# EAGLE design moduloComunicacao4.1-smd (EAGLE 9.5.2)
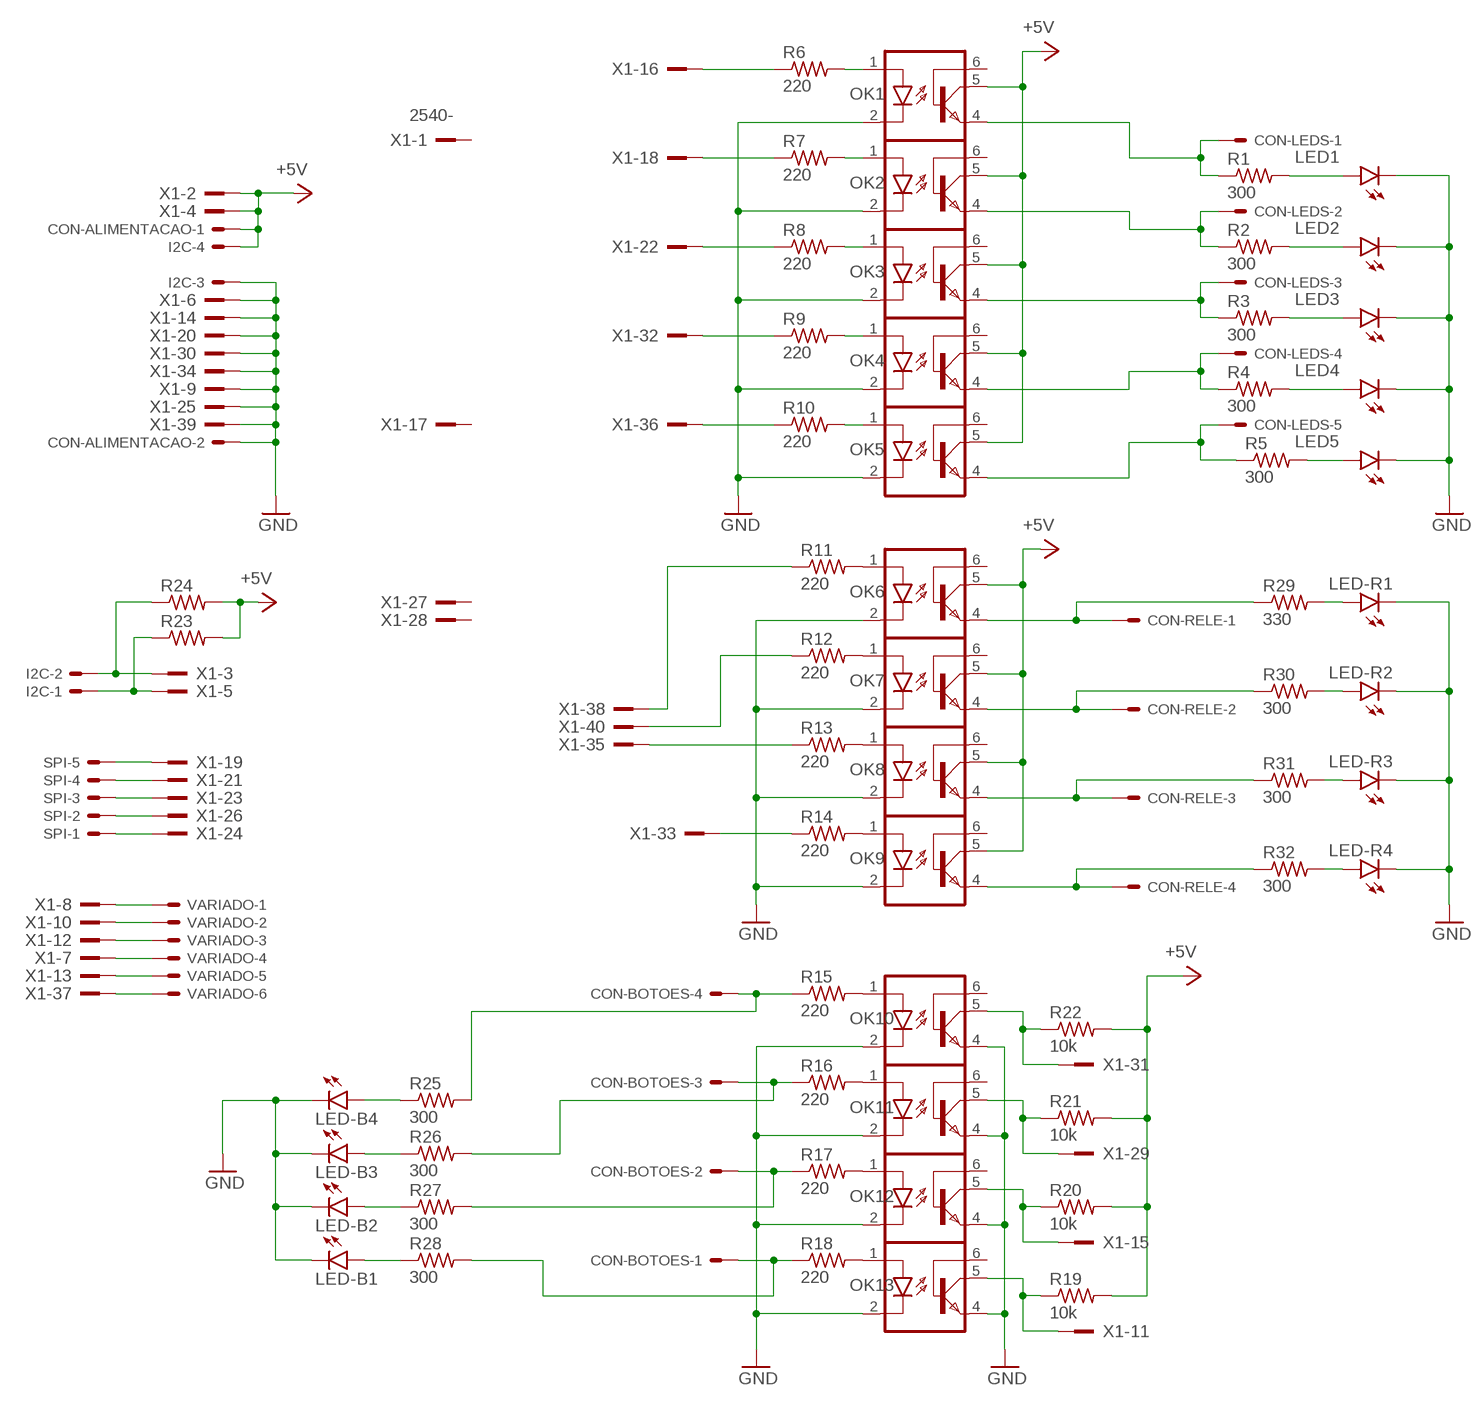
[diagram p0: schematic, sheet 1]

## Parts
CON-ALIMENTACAO  22-23-2021  [22-23-2021]
CON-BOTOES  22-23-2041  [22-23-2041]
CON-LEDS  22-23-2051  [22-23-2051]
CON-RELE  22-23-2041  [22-23-2041]
I2C  22-23-2041  [22-23-2041]
LED1  LED5MM  [LED5MM]
LED2  LED5MM  [LED5MM]
LED3  LED5MM  [LED5MM]
LED4  LED5MM  [LED5MM]
LED5  LED5MM  [LED5MM]
LED-B1  LEDCHIP-LED0805  [CHIP-LED0805]
LED-B2  LEDCHIP-LED0805  [CHIP-LED0805]
LED-B3  LEDCHIP-LED0805  [CHIP-LED0805]
LED-B4  LEDCHIP-LED0805  [CHIP-LED0805]
LED-R1  LEDCHIP-LED0805  [CHIP-LED0805]
LED-R2  LEDCHIP-LED0805  [CHIP-LED0805]
LED-R3  LEDCHIP-LED0805  [CHIP-LED0805]
LED-R4  LEDCHIP-LED0805  [CHIP-LED0805]
OK1  4N25M  [DIL06]
OK2  4N25M  [DIL06]
OK3  4N25M  [DIL06]
OK4  4N25M  [DIL06]
OK5  4N25M  [DIL06]
OK6  4N25M  [DIL06]
OK7  4N25M  [DIL06]
OK8  4N25M  [DIL06]
OK9  4N25M  [DIL06]
OK10  4N25M  [DIL06]
OK11  4N25M  [DIL06]
OK12  4N25M  [DIL06]
OK13  4N25M  [DIL06]
R1  300  R-US_0207/12  [0207/12]
R2  300  R-US_0207/12  [0207/12]
R3  300  R-US_0207/12  [0207/12]
R4  300  R-US_0207/12  [0207/12]
R5  300  R-US_0207/12  [0207/12]
R6  220  R-US_0204/7  [0204/7]
R7  220  R-US_0204/7  [0204/7]
R8  220  R-US_0204/7  [0204/7]
R9  220  R-US_0204/7  [0204/7]
R10  220  R-US_0204/7  [0204/7]
R11  220  R-US_0204/7  [0204/7]
R12  220  R-US_0204/7  [0204/7]
R13  220  R-US_0204/7  [0204/7]
R14  220  R-US_0204/7  [0204/7]
R15  220  R-US_0207/10  [0207/10]
R16  220  R-US_0207/10  [0207/10]
R17  220  R-US_0207/10  [0207/10]
R18  220  R-US_0207/10  [0207/10]
R19  10k  R-US_0204/7  [0204/7]
R20  10k  R-US_0204/7  [0204/7]
R21  10k  R-US_0204/7  [0204/7]
R22  10k  R-US_0204/7  [0204/7]
R23  R-US_0204/5  [0204/5]
R24  R-US_0204/5  [0204/5]
R25  300  R-US_R0805  [R0805]
R26  300  R-US_R0805  [R0805]
R27  300  R-US_R0805  [R0805]
R28  300  R-US_R0805  [R0805]
R29  330  R-US_R0805  [R0805]
R30  300  R-US_R0805  [R0805]
R31  300  R-US_R0805  [R0805]
R32  300  R-US_R0805  [R0805]
SPI  22-23-2051  [22-23-2051]
VARIADO  22-23-2061  [22-23-2061]
X1  2540-  [PAK100/2500-40]

## Nets
+5V: CON-ALIMENTACAO.1 I2C.4 OK1.5(COL) OK2.5(COL) OK3.5(COL) OK4.5(COL) OK5.5(COL) OK6.5(COL) OK7.5(COL) OK8.5(COL) OK9.5(COL) R19.2 R20.2 R21.2 R22.2 R23.2 R24.2 X1.2 X1.4
GND: CON-ALIMENTACAO.2 I2C.3 LED1.K(C) LED2.K(C) LED3.K(C) LED4.K(C) LED5.K(C) LED-B1.C LED-B2.C LED-B3.C LED-B4.C LED-R1.C LED-R2.C LED-R3.C LED-R4.C OK1.2(C) OK2.2(C) OK3.2(C) OK4.2(C) OK5.2(C) OK6.2(C) OK7.2(C) OK8.2(C) OK9.2(C) OK10.2(C) OK10.4(EMI) OK11.2(C) OK11.4(EMI) OK12.2(C) OK12.4(EMI) OK13.2(C) OK13.4(EMI) X1.6 X1.9 X1.14 X1.20 X1.25 X1.30 X1.34 X1.39
N$1: LED1.A R1.2
N$2: LED2.A R2.2
N$3: LED3.A R3.2
N$4: LED4.A R4.2
N$5: LED5.A R5.2
N$6: CON-LEDS.1 OK1.4(EMI) R1.1
N$7: CON-LEDS.2 OK2.4(EMI) R2.1
N$8: CON-LEDS.3 OK3.4(EMI) R3.1
N$9: CON-LEDS.4 OK4.4(EMI) R4.1
N$10: CON-LEDS.5 OK5.4(EMI) R5.1
N$11: CON-RELE.1 OK6.4(EMI) R29.1
N$12: CON-RELE.2 OK7.4(EMI) R30.1
N$13: OK1.1(A) R6.2
N$14: OK2.1(A) R7.2
N$15: OK3.1(A) R8.2
N$16: OK4.1(A) R9.2
N$17: OK5.1(A) R10.2
N$18: CON-RELE.3 OK8.4(EMI) R31.1
N$19: CON-RELE.4 OK9.4(EMI) R32.1
N$20: OK6.1(A) R11.2
N$21: OK7.1(A) R12.2
N$22: OK8.1(A) R13.2
N$23: OK9.1(A) R14.2
N$24: OK10.1(A) R15.2
N$25: OK11.1(A) R16.2
N$26: OK12.1(A) R17.2
N$27: OK13.1(A) R18.2
N$28: CON-BOTOES.4 R15.1 R25.2
N$29: CON-BOTOES.2 R17.1 R27.2
N$30: CON-BOTOES.3 R16.1 R26.2
N$31: CON-BOTOES.1 R18.1 R28.2
N$32: OK13.5(COL) R19.1 X1.11
N$33: R13.1 X1.35
N$34: OK12.5(COL) R20.1 X1.15
N$35: R12.1 X1.40
N$36: OK11.5(COL) R21.1 X1.29
N$37: R14.1 X1.33
N$38: OK10.5(COL) R22.1 X1.31
N$39: R11.1 X1.38
N$40: R6.1 X1.16
N$41: R7.1 X1.18
N$42: R8.1 X1.22
N$43: R9.1 X1.32
N$44: R10.1 X1.36
N$45: I2C.2 R24.1 X1.3
N$46: I2C.1 R23.1 X1.5
N$47: SPI.5 X1.19
N$48: SPI.4 X1.21
N$49: SPI.3 X1.23
N$50: SPI.2 X1.26
N$51: SPI.1 X1.24
N$52: VARIADO.3 X1.12
N$53: VARIADO.2 X1.10
N$54: VARIADO.1 X1.8
N$55: VARIADO.4 X1.7
N$56: VARIADO.5 X1.13
N$57: VARIADO.6 X1.37
N$58: LED-B4.A R25.1
N$59: LED-B3.A R26.1
N$60: LED-B2.A R27.1
N$61: LED-B1.A R28.1
N$62: LED-R4.A R32.2
N$63: LED-R3.A R31.2
N$64: LED-R2.A R30.2
N$65: LED-R1.A R29.2
Unconnected: OK1.6(BAS) OK2.6(BAS) OK3.6(BAS) OK4.6(BAS) OK5.6(BAS) OK6.6(BAS) OK7.6(BAS) OK8.6(BAS) OK9.6(BAS) OK10.6(BAS) OK11.6(BAS) OK12.6(BAS) OK13.6(BAS) X1.1 X1.17 X1.27 X1.28

## Library data of the parts
CON-ALIMENTACAO = con-molex:22-23-2021: .100" (2.54mm) Center Header - 2 Pin; MF: MOLEX; MPN: 22-23-2021; OC_FARNELL: 1462926; OC_NEWARK: 25C3832
CON-BOTOES CON-RELE I2C = con-molex:22-23-2041: .100" (2.54mm) Center Header - 4 Pin; MF: MOLEX; MPN: 22-23-2041; OC_FARNELL: 1462920; OC_NEWARK: 38C0355
CON-LEDS SPI = con-molex:22-23-2051: .100" (2.54mm) Center Header - 5 Pin; MF: MOLEX; MPN: 22-23-2051; OC_FARNELL: 1462952; OC_NEWARK: 38C9178
LED1-LED5 LED-B1-LED-B4 LED-R1-LED-R4 = led:LED: LED OSRAM: - CHIPLED LG R971, LG N971, LY N971, LG Q971, LY Q971, LO R971, LY R971 LH N974, LH R974 LS Q976, LO Q976, LY Q976 LO Q996 - Hyper CHIPLED LW Q18S LB Q993, LB Q99A, LB R99A - SideLED LS A670, LO A670, LY A670, LG A670, LP A670 LB A673, LV A673, LT A673, LW A673 LH A674 LY A675 LS A676, LA A676, LO A676, LY A676, LW A676 LS A679, LY A679, LG A679 - Hyper Micro SIDELED® LS Y876, LA Y876, LO Y876, LY Y876 LT Y87S - SmartLED LW L88C, LW L88S LB L89C, LB L89S, LG L890 LS L89K, LO L89K, LY L89K LS L896, LA L896, LO L896, LY L896 - TOPLED LS T670, LO T670, LY T670, LG T670, LP T670 LSG T670, LSP T670, LSY T670, LOP T670, LYG T670 LG T671, LOG T671, LSG T671 LB T673, LV T673, LT T673, LW T673 LH T674 LS T676, LA T676, LO T676, LY T676, LB T676, LH T676, LSB T676, LW T676 LB T67C, LV T67C, LT T67C, LS T67K, LO T67K, LY T67K, LW E67C LS E67B, LA E67B, LO E67B, LY E67B, LB E67C, LV E67C, LT E67C LW T67C LS T679, LY T679, LG T679 LS T770, LO T770, LY T770, LG T770, LP T770 LB T773, LV T773, LT T773, LW T773 LH T774 LS E675, LA E675, LY E675, LS T675 LS T776, LA T776, LO T776, LY T776, LB T776 LHGB T686 LT T68C, LB T68C - Hyper Mini TOPLED® LB M676 - Mini TOPLED Santana® LG M470 LS M47K, LO M47K, LY M47K Source: http://www.osram.convergy.de LUXEON: - LUMILED® LXK2-PW12-R00, LXK2-PW12-S00, LXK2-PW14-U00, LXK2-PW14-V00 LXK2-PM12-R00, LXK2-PM12-S00, LXK2-PM14-U00 LXK2-PE12-Q00, LXK2-PE12-R00, LXK2-PE12-S00, LXK2-PE14-T00, LXK2-PE14-U00 LXK2-PB12-K00, LXK2-PB12-L00, LXK2-PB12-M00, LXK2-PB14-N00, LXK2-PB14-P00, LXK2-PB14-Q00 LXK2-PR12-L00, LXK2-PR12-M00, LXK2-PR14-Q00, LXK2-PR14-R00 LXK2-PD12-Q00, LXK2-PD12-R00, LXK2-PD12-S00 LXK2-PH12-R00, LXK2-PH12-S00 LXK2-PL12-P00, LXK2-PL12-Q00, LXK2-PL12-R00 Source: www.luxeon.com KINGBRIGHT: KA-3528ASYC Source: www.kingbright.com
OK1-OK13 = optocoupler:4N*?M: General Purpose 6-Pin Phototransistor Optocouplers Source: http://www.fairchildsemi.com/ds/4N/4N35-M.pdf; MPN: 4N25-M; OC_FARNELL: 1021349; OC_NEWARK: 98K9084
R1-R32 = rcl:R-US_: RESISTOR, American symbol; SPICEPREFIX: R
VARIADO = con-molex:22-23-2061: .100" (2.54mm) Center Header - 6 Pin; MF: MOLEX; MPN: 22-23-2061; OC_FARNELL: 1462922; OC_NEWARK: 27C1933
X1 = con-3m:2540-: 3M (TM) Pak 100 4-Wall Header Source: 3M; OC_FARNELL: unknown; OC_NEWARK: unknown

## Board
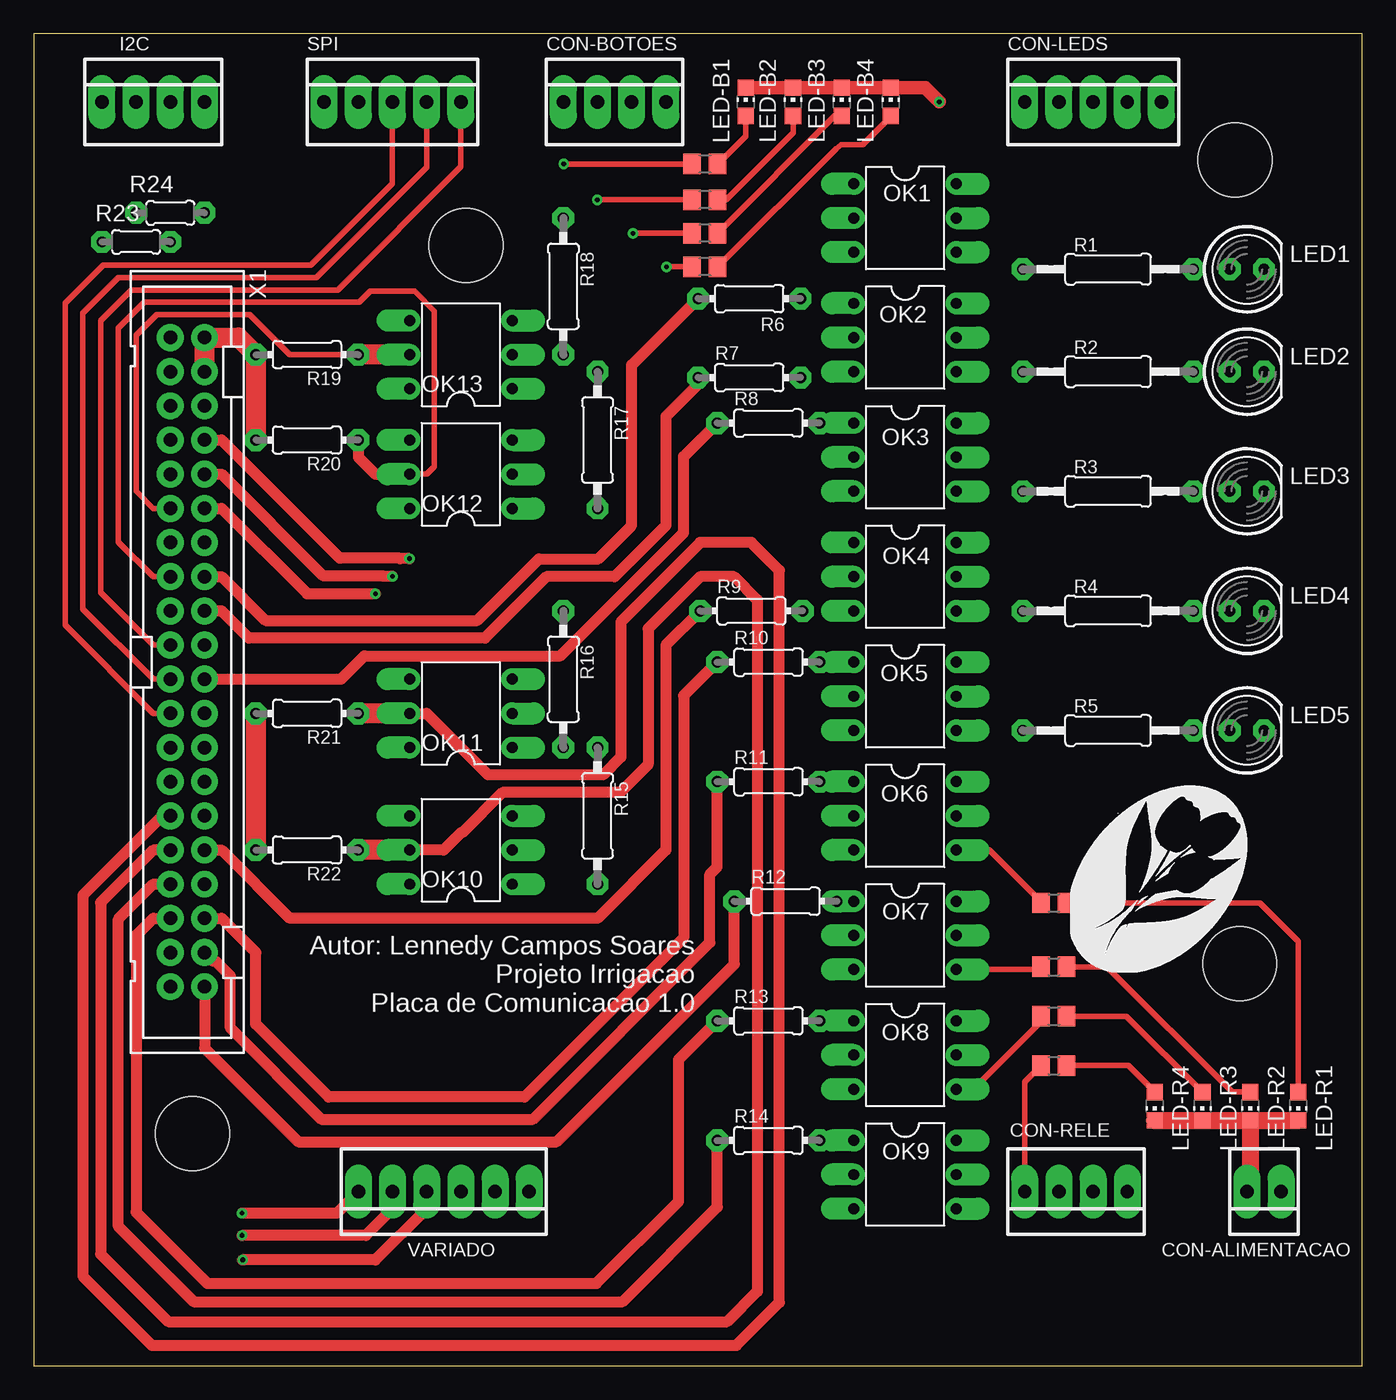
[diagram p1: board, top side]
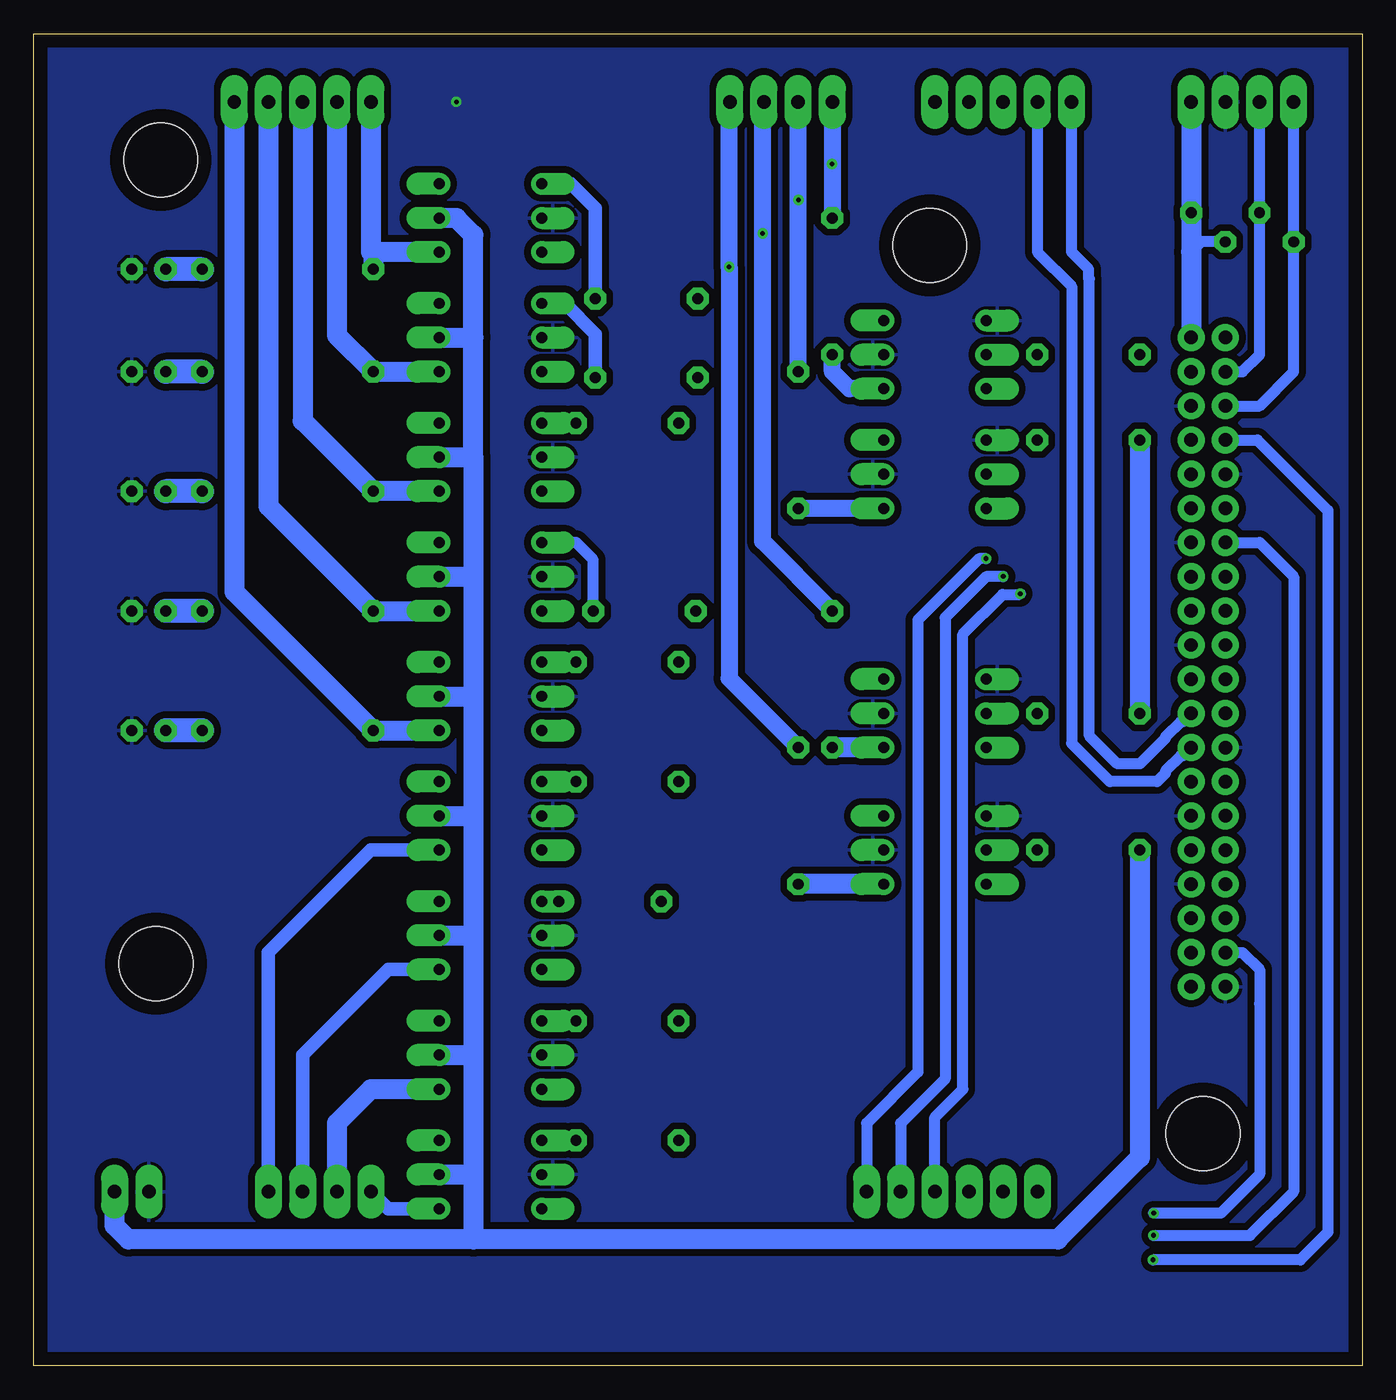
[diagram p2: board, bottom side, seen from below]

Size 98.73 x 99.05 mm. Coordinates in mm from the lower left corner, seen from the top.
Outline: 0,0 98.73,0 98.73,99.05 0,99.05 0,0
Copper layers (1*16): Top 0.035mm / dielectric 1.5mm / Bottom 0.035mm
Design rules "default *": minimum track width 6mil, minimum drill 0.35mm, track to track 20mil, track to pad 20mil, pad to pad 20mil, via to via 20mil, smd to smd 6mil, copper to edge 40mil, drill to drill 6mil, minimum pad ring 10mil, minimum via ring 8mil, stop-mask expansion 4mil, vias tented up to drill 0mil, thermal gap 10mil
Holes 5.5 mm at 11.81,17.27 89.64,29.9 32.13,83.31 89.28,89.66

### Footprints (pad centres in the part's own frame; a part is rotated, then mirrored left to right if it is on the bottom)
22-23-2021 = drill 1 long: 1 -1.27,0; 2 1.27,0
22-23-2041 = drill 1 long: 1 -3.81,0; 2 -1.27,0; 3 1.27,0; 4 3.81,0
22-23-2051 = drill 1 long: 1 -5.08,0; 2 -2.54,0; 3 0,0; 4 2.54,0; 5 5.08,0
LED5MM = drill 0.813 octagon: A -1.27,0; K 1.27,0
CHIP-LED0805 = smd 1.2 x 1.2: A 0,-1.05; C 0,1.05
DIL06 = drill 0.813 offset: 1 -2.54,-3.81; 2 0,-3.81; 3 2.54,-3.81; 4 2.54,3.81; 5 0,3.81; 6 -2.54,3.81
0207/12 = drill 0.813 octagon: 1 -6.35,0; 2 6.35,0
0204/7 = drill 0.813 octagon: 1 -3.81,0; 2 3.81,0
0207/10 = drill 0.813 octagon: 1 -5.08,0; 2 5.08,0
0204/5 = drill 0.813 octagon: 1 -2.54,0; 2 2.54,0
R0805 = smd 1.3 x 1.5: 1 -0.95,0; 2 0.95,0
22-23-2061 = drill 1 long: 1 -6.35,0; 2 -3.81,0; 3 -1.27,0; 4 1.27,0; 5 3.81,0; 6 6.35,0
PAK100/2500-40 = drill 1 pad 1.422: 1 -24.13,-1.27; 2 -24.13,1.27; 3 -21.59,-1.27; 4 -21.59,1.27; 5 -19.05,-1.27; 6 -19.05,1.27; 7 -16.51,-1.27; 8 -16.51,1.27; 9 -13.97,-1.27; 10 -13.97,1.27; 11 -11.43,-1.27; 12 -11.43,1.27; 13 -8.89,-1.27; 14 -8.89,1.27; 15 -6.35,-1.27; 16 -6.35,1.27; 17 -3.81,-1.27; 18 -3.81,1.27; 19 -1.27,-1.27; 20 -1.27,1.27; 21 1.27,-1.27; 22 1.27,1.27; 23 3.81,-1.27; 24 3.81,1.27; 25 6.35,-1.27; 26 6.35,1.27; 27 8.89,-1.27; 28 8.89,1.27; 29 11.43,-1.27; 30 11.43,1.27; 31 13.97,-1.27; 32 13.97,1.27; 33 16.51,-1.27; 34 16.51,1.27; 35 19.05,-1.27; 36 19.05,1.27; 37 21.59,-1.27; 38 21.59,1.27; 39 24.13,-1.27; 40 24.13,1.27

### Placement (x,y rotation side)
CON-ALIMENTACAO  91.44,12.95 180 top
CON-BOTOES  43.18,93.98 0 top
CON-LEDS  78.74,93.98 0 top
CON-RELE  77.47,12.95 180 top
I2C  8.89,93.98 0 top
LED1  90.17,81.53 0 top
LED2  90.17,73.91 0 top
LED3  90.17,65.02 0 top
LED4  90.17,56.13 0 top
LED5  90.17,47.24 0 top
LED-B1  52.92,93.98 0 top
LED-B2  56.44,93.98 0 top
LED-B3  60.07,93.98 0 top
LED-B4  63.7,93.98 0 top
LED-R1  93.98,19.3 180 top
LED-R2  90.42,19.3 180 top
LED-R3  86.87,19.3 180 top
LED-R4  83.31,19.3 180 top
OK1  64.77,85.34 270 top
OK2  64.77,76.45 270 top
OK3  64.77,67.56 270 top
OK4  64.77,58.67 270 top
OK5  64.77,49.78 270 top
OK6  64.77,40.89 270 top
OK7  64.77,32 270 top
OK8  64.77,23.11 270 top
OK9  64.77,14.22 270 top
OK10  31.75,38.35 90 top
OK11  31.75,48.51 90 top
OK12  31.75,66.29 90 top
OK13  31.75,75.18 90 top
R1  79.85,81.53 0 top
R2  79.85,73.91 0 top
R3  79.85,65.02 0 top
R4  79.85,56.13 0 top
R5  79.85,47.24 0 top
R6  53.19,79.35 0 top
R7  53.19,73.48 0 top
R8  54.61,70.1 0 top
R9  53.34,56.13 0 top
R10  54.61,52.32 0 top
R11  54.61,43.43 0 top
R12  55.88,34.54 0 top
R13  54.61,25.65 0 top
R14  54.61,16.76 0 top
R15  41.91,40.89 270 top
R16  39.37,51.05 270 top
R17  41.91,68.83 270 top
R18  39.37,80.26 270 top
R19  20.32,75.18 180 top
R20  20.32,68.83 180 top
R21  20.32,48.51 180 top
R22  20.32,38.35 180 top
R23  7.62,83.57 0 top
R24  10.16,85.72 0 top
R25  49.89,81.71 180 top
R26  49.89,84.2 180 top
R27  49.89,86.69 180 top
R28  49.89,89.36 180 top
R29  75.83,34.42 0 top
R30  75.83,29.68 0 top
R31  75.83,26 0 top
R32  75.83,22.33 0 top
SPI  26.67,93.98 0 top
VARIADO  30.48,12.95 180 top
X1  11.43,52.32 270 top

### Tracks (layer width: path | path; a pad name or v marks a point on that pad's centre or on a via)
+5V
  Top 1.5: R21.2 R22.2 | R20.2 R19.2 15.24,76.45 X1.2 X1.4
  Bottom 0.813: R23.2 11.94,83.57 12.7,82.8 | R24.2 12.7,85.34
  Bottom 1.5: 66.04,9.4 22.61,9.4 16.51,15.49 R22.2 | 66.04,9.4 91.69,9.4 92.71,10.41 CON-ALIMENTACAO.1 | 66.04,67.56 66.04,76.45 | 66.04,67.56 66.04,58.67 | 66.04,58.67 66.04,49.78 | 66.04,49.78 66.04,40.89 | 66.04,40.89 66.04,32 | 66.04,32 66.04,23.11 | 66.04,23.11 66.04,14.22 | 66.04,14.22 66.04,9.4 | OK9.5 66.04,14.22 | OK8.5 66.04,23.11 | OK7.5 66.04,32 | OK6.5 66.04,40.89 | OK5.5 66.04,49.78 | OK4.5 66.04,58.67 | OK3.5 66.04,67.56 | OK2.5 66.04,76.45 | R20.2 R21.2 | 66.04,76.45 66.04,84.07 67.31,85.34 OK1.5 | I2C.4 12.7,85.34 12.7,82.8 X1.2
GND  (via drill 0.35)
  Top 1.016: LED-B1.C LED-B2.C LED-B3.C LED-B4.C 66.26,95.03 v67.31,93.98
  Top 1.27: LED-R4.C LED-R3.C LED-R2.C | LED-R2.C LED-R1.C | LED-R2.C 90.42,13.21 CON-ALIMENTACAO.2
  pour Bottom: 0,99.06 99.06,99.06 99.06,0 0,0
N$1
  Bottom 1.8: R1.2 LED1.A
N$2
  Bottom 1.8: R2.2 LED2.A
N$3
  Bottom 1.8: R3.2 LED3.A
N$4
  Bottom 1.8: R4.2 LED4.A
N$5
  Bottom 1.8: R5.2 LED5.A
N$6
  Bottom 1.5: CON-LEDS.1 73.66,82.8 73.5,82.8 | 73.5,82.8 R1.1 | OK1.4 73.5,82.8
N$7
  Bottom 1.5: CON-LEDS.2 76.2,76.61 R2.1 OK2.4
N$8
  Bottom 1.5: OK3.4 R3.1 78.74,70.26 CON-LEDS.3
N$9
  Bottom 1.5: CON-LEDS.4 81.28,63.91 R4.1 OK4.4
N$10
  Bottom 1.5: CON-LEDS.5 83.82,57.56 R5.1 OK5.4
N$11
  Top 0.406: OK6.4 71.02,38.35 74.88,34.49 R29.1
  Bottom 1.016: CON-RELE.1 81.28,30.73 73.66,38.35 OK6.4
N$12
  Top 0.406: OK7.4 74.67,29.46 R30.1
  Bottom 1.016: CON-RELE.2 78.74,23.11 72.39,29.46 OK7.4
N$13
  Bottom 1.016: OK1.1 58.83,87.88 57,86.05 R6.2
N$14
  Bottom 1.016: OK2.1 59.27,78.99 57,76.72 R7.2
N$15
  Bottom 1.016: OK3.1 R8.2
N$16
  Bottom 0.813: R9.2 57.15,59.94 58.42,61.21 OK4.1
N$17
  Bottom 1.016: R10.2 OK5.1
N$18
  Top 0.406: OK8.4 69.82,20.57 74.88,25.63 R31.1
  Bottom 1.5: OK8.4 73.66,20.57 76.2,18.03 CON-RELE.3
N$19
  Top 0.406: CON-RELE.4 73.66,21.11 R32.1
  Bottom 1.016: OK9.4 72.39,11.68 CON-RELE.4
N$20
  Bottom 1.016: R11.2 OK6.1
N$21
  Bottom 1.016: OK7.1 R12.2
N$22
  Bottom 1.016: OK8.1 R13.2
N$23
  Bottom 1.016: OK9.1 R14.2
N$24
  Bottom 1.5: OK10.1 R15.2
N$25
  Bottom 1.5: OK11.1 R16.2
N$26
  Bottom 1.27: OK12.1 R17.2
N$27
  Bottom 1.27: OK13.1 38.1,72.64 39.37,73.91 R18.2
N$28  (via drill 0.35)
  Top 0.406: R25.2 v47.04,81.71
  Bottom 1.27: CON-BOTOES.4 47.04,93.93 v47.04,81.71 47.04,51.1 R15.1
N$29  (via drill 0.35)
  Top 0.406: R27.2 v41.88,86.69
  Bottom 0.406: v41.88,86.69 41.88,86.84 41.91,86.87
  Bottom 1.27: R17.1 41.91,86.87 CON-BOTOES.2
N$30  (via drill 0.35)
  Top 0.406: R26.2 v44.55,84.2
  Bottom 1.27: R16.1 44.55,61.32 v44.55,84.2 44.55,93.88 CON-BOTOES.3
N$31  (via drill 0.35)
  Top 0.406: R28.2 v39.39,89.36
  Bottom 0.406: v39.39,89.36 39.37,89.36
  Bottom 1.27: CON-BOTOES.1 39.37,89.36 R18.1
N$32
  Top 0.406: R19.1 19.05,75.18 16.07,78.16 9.16,78.16 7.62,76.62 7.62,65.02 8.89,63.75 X1.11
  Top 1.5: OK13.5 R19.1
N$33
  Top 0.813: X1.35 8.89,33.27 7.62,32 7.62,11.43 12.92,6.13 41.83,6.13 47.93,12.23 47.93,22.78 R13.1
N$34
  Top 0.406: X1.15 8.89,58.67 6.3,61.26 6.3,77.17 8.21,79.08 24.22,79.08 25.03,79.89 28.31,79.89 29.78,78.42 29.78,66.87 29.21,66.29 OK12.5
  Top 0.813: R20.1 24.13,67.56 25.4,66.29 OK12.5
N$35
  Top 0.813: X1.40 12.7,23.61 19.65,16.66 38.87,16.66 52.07,29.86 R12.1
N$36
  Top 0.813: X1.29 9.56,40.89 3.66,34.99 3.66,6.66 8.8,1.52 52.23,1.52 55.42,4.71 55.42,59.13 53.34,61.21 49.53,61.21 43.64,55.32 43.64,45.26 42.32,43.94 33.78,43.94 29.21,48.51 OK11.5
  Top 1.5: OK11.5 R21.1
N$37
  Top 0.813: X1.33 8.89,35.81 6.3,33.22 6.3,10.37 11.9,4.77 43.77,4.77 50.81,11.82 R14.1
N$38
  Top 0.813: X1.31 8.89,38.35 4.98,34.44 4.98,8.31 10,3.28 51.54,3.28 53.8,5.54 53.8,56.95 52.07,58.67 49.53,58.67 45.67,54.81 45.67,44.7 43.59,42.62 34.84,42.62 31.85,39.62 31.75,39.62 30.48,38.35 OK10.5
  Top 1.5: OK10.5 R22.1
N$39
  Top 0.813: R11.1 50.8,37.08 50.26,36.54 50.26,31.47 37.13,18.34 21.39,18.34 14.61,25.11 14.61,28.99 13.49,30.11 13.33,30.11 X1.38
N$40
  Top 0.813: R6.1 44.45,74.42 44.45,62.48 41.96,59.99 37.55,59.99 32.98,55.42 17.22,55.42 13.97,58.67 X1.16
N$41
  Top 0.813: R7.1 49.38,72.97 46.99,70.59 46.99,62.48 43.18,58.67 38.1,58.67 33.53,54.1 16,54.1 13.97,56.13 X1.18
N$42
  Top 0.813: R8.1 48.31,67.61 48.31,61.94 39.15,52.78 24.59,52.78 22.86,51.05 X1.22
N$43
  Top 0.813: X1.32 13.97,38.35 19.05,33.27 41.91,33.27 46.99,38.35 46.99,53.59 R9.1
N$44
  Top 0.813: R10.1 48.31,49.83 48.31,31.81 36.5,20 21.92,20 16.49,25.42 16.49,30.72 16.51,30.73 13.97,33.27 X1.36
N$45
  Bottom 0.813: X1.3 8.89,73.91 7.62,75.18 R24.1 I2C.2
N$46
  Bottom 0.813: X1.5 7.62,71.37 5.08,73.91 R23.1 I2C.1
N$47
  Top 0.406: SPI.5 31.75,89.15 22.59,79.99 7.26,79.99 4.98,77.72 4.98,57.51 8.89,53.59 X1.19
N$48
  Top 0.406: SPI.4 29.21,89.13 20.99,80.91 6.3,80.91 3.66,78.26 3.66,56.29 8.89,51.05 X1.21
N$49
  Top 0.406: SPI.3 26.67,87.88 20.61,81.82 5.17,81.82 2.34,78.99 2.34,55.07 8.89,48.51 X1.23
N$50
  Bottom 0.813: SPI.2 24.13,82.8 21.59,80.26 21.59,46.28 18.74,43.43 15.24,43.43 14.61,44.06 14.61,44.23 13.49,45.35 13.33,45.35 X1.26
N$51
  Bottom 0.813: SPI.1 21.59,82.8 20.32,81.53 20.32,80.86 20.27,80.81 20.27,46.84 18.19,44.75 16.51,44.75 14.61,46.65 14.61,46.77 13.49,47.89 13.33,47.89 X1.24
N$52  (via drill 0.35)
  Top 0.813: X1.12 13.97,63.75 20.32,57.4 v25.4,57.4
  Bottom 0.813: v25.4,57.4 25.45,57.35 26.72,57.35 29.67,54.41 29.67,20.57 31.75,18.49 VARIADO.3
N$53  (via drill 0.35)
  Top 0.813: X1.10 13.97,66.29 21.54,58.72 25.95,58.72 25.97,58.7 v26.67,58.7
  Bottom 0.813: v26.67,58.7 26.69,58.67 27.94,58.67 30.99,55.63 30.99,21.34 34.29,18.03 VARIADO.2
N$54  (via drill 0.35)
  Top 0.813: X1.8 13.97,68.83 22.76,60.05 27.22,60.05 27.24,60.02 v27.94,60.02
  Bottom 0.813: v27.94,60.02 28.46,60.02 33.02,55.46 33.02,21.84 36.83,18.03 VARIADO.1
N$55  (via drill 0.35)
  Top 0.813: VARIADO.4 29.21,11.68 25.4,7.87 v15.54,7.87 v15.53,7.88
  Bottom 0.813: X1.7 7.77,68.83 2.54,63.6 2.54,9.93 4.59,7.88 v15.53,7.88
N$56  (via drill 0.35)
  Top 0.813: v15.49,9.7 24.69,9.7 26.67,11.68 VARIADO.5
  Bottom 0.813: X1.13 7.62,61.21 5.08,58.67 5.08,12.95 8.33,9.7 v15.49,9.7
N$57  (via drill 0.35)
  Top 0.813: VARIADO.6 22.53,11.35 v15.49,11.35
  Bottom 0.813: X1.37 8.89,30.73 7.62,29.46 7.62,26.93 7.62,14.22 10.49,11.35 v15.49,11.35
N$58
  Top 0.406: R25.1 59.63,90.51 60.02,90.78 61.62,90.78 63.7,92.86 LED-B4.A
N$59
  Top 0.406: R26.1 50.84,84.23 59.53,92.93 LED-B3.A
N$60
  Top 0.406: R27.1 51.49,86.69 56.46,91.67 56.46,92.9 LED-B2.A
N$61
  Top 0.406: R28.1 52.91,91.44 LED-B1.A
N$62
  Top 0.406: R32.2 81.34,22.33 LED-R4.A
N$63
  Top 0.406: LED-R3.A 81.22,26 R31.2
N$64
  Top 0.406: LED-R2.A 89.07,20.35 79.75,29.68 R30.2
N$65
  Top 0.406: R29.2 | R29.2 91.13,34.42 93.98,31.57 LED-R1.A

### Text on the board
tNames: Autor: Lennedy Campos Soares / Projeto Irrigacao / Placa de Comunicacao 1.0